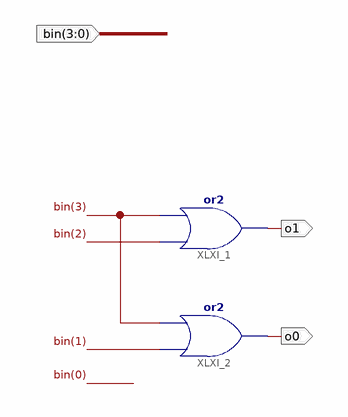
[diagram p0: schematic sheet 1]
// Xilinx ISE schematic encoder_4to2.sch (spartan6) as structural Verilog: 2 symbols, 3 ports
module encoder_4to2 (
  input  [3:0] bin,
  output o1,
  output o0
);

  or XLXI_1 (o1, bin[2], bin[3]);
  or XLXI_2 (o0, bin[1], bin[3]);
endmodule
